# Altium schematic sheet MainBoard_Power.SchDoc: Main Board Power
size A4; DrawnBy: M. Schwegler; Organization: HSLU T&A; Address1: Abteilung Elektrotechnik; Address2: Technikumsstrasse 21; Address3: CH-6048 Horw; Revision: v1; SheetNumber: 1; SheetTotal: 5; Projektname: SmartBoard; DocumentName: Main Board Power
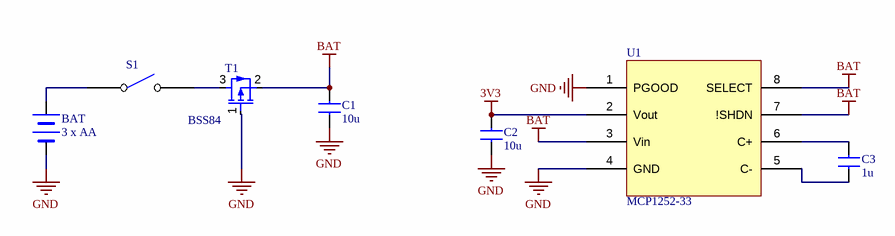
[diagram p0: MainBoard_Power.SchDoc]

## Parts
BAT  3 x AA  [SIP2]
C1  10u  [0805_C]
C2  10u  [0805_C]
C3  1u  [0805_C]
S1  SW SPST  [SIP2]  (value not drawn)
T1  BSS84  [SOT23-3]
U1  MCP1252-33  [MSOP8]

## Nets
3V3: C2.2 U1.2(Vout)
BAT: C1.2 T1.2(S) U1.3(Vin) U1.7(!SHDN) U1.8(SELECT)
GND: BAT.2 C1.1 C2.1 T1.1(G) U1.1(PGOOD) U1.4(GND)
NetBAT_1: BAT.1 S1.1(COMMON)
NetC3_1: C3.1 U1.5(C-)
NetC3_2: C3.2 U1.6(C+)
NetS1_2: S1.2(NO) T1.3(D)

## Notes on the sheet
- Project:
- Drawn by:
- Size:
- Sheet
- A4
- Rev.:
- of
- Date:
- File:

## Library data of the parts
BAT = BATTERY
C1-C3 = C?: Normaler Kondensator
T1 = MOSFET-P 1G,2D,3S (Diode)
U1 = VOLTREG